# EAGLE schematic 3MIC_backplaneREVA (EAGLE 7.7.0)
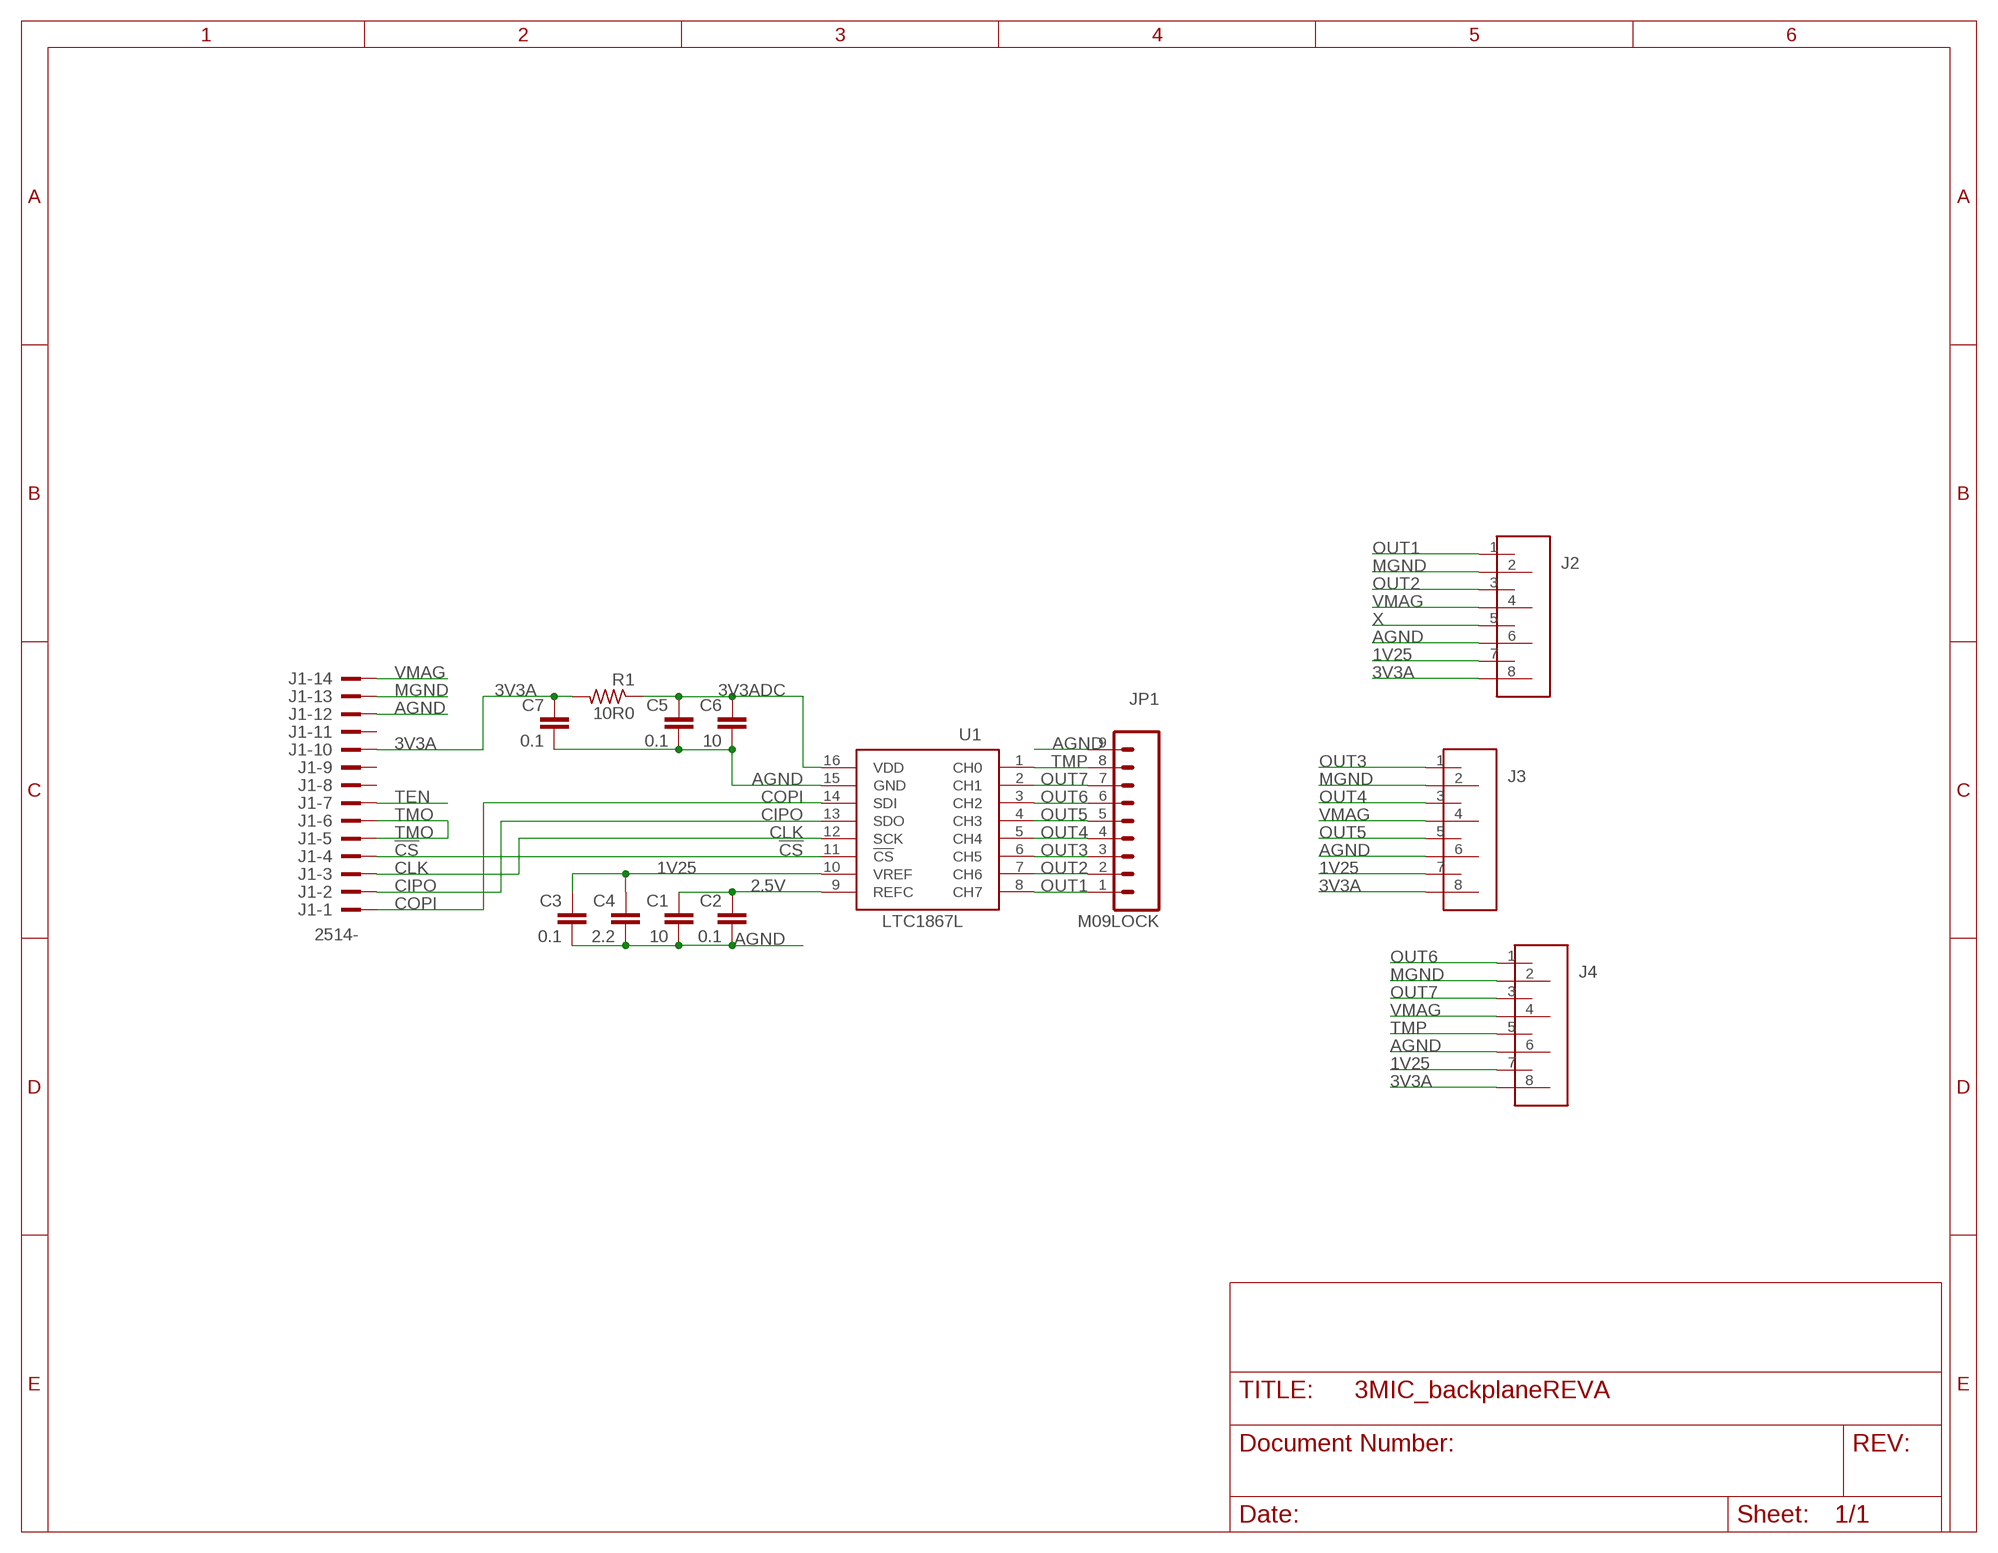
[diagram p0: schematic, sheet 1]

## Parts
C1  10  CAPS0805S  [0805S]
C2  0.1  CAPS0603S  [0603S]
C3  0.1  CAPS0603S  [0603S]
C4  2.2  CAPS0805S  [0805S]
C5  0.1  CAPS0603S  [0603S]
C6  10  CAPS0805S  [0805S]
C7  0.1  CAPS0603S  [0603S]
J1  2514-  [PAK100/2500-14]
J2  CON84X2SHROUDED  [4X2SHROUDED]
J3  CON84X2SHROUDED  [4X2SHROUDED]
J4  CON84X2SHROUDED  [4X2SHROUDED]
JP1  M09LOCK  [1X09_LOCK]
R1  10R0  RESISTOR_SM0805S  [0805S]
U1  LTC1867L  LTC1867  [SSOP16]

## Nets
1V25: C3.1 C4.1 J2.7 J3.7 J4.7 U1.10(VREF)
2.5V: C1.1 C2.1 U1.9(REFC)
3V3A: C7.1 J1.10 J2.8 J3.8 J4.8 R1.2
3V3ADC: C5.1 C6.1 R1.1 U1.16(VDD)
!CS: J1.4 U1.11(!CS)
AGND: C1.2 C2.2 C3.2 C4.2 C5.2 C6.2 C7.2 J1.12 J2.6 J3.6 J4.6 JP1.9 U1.15(GND)
CIPO: J1.2 U1.13(SDO)
CLK: J1.3 U1.12(SCK)
COPI: J1.1 U1.14(SDI)
MGND: J1.13 J2.2 J3.2 J4.2
OUT1: J2.1 JP1.1 U1.8(CH7)
OUT2: J2.3 JP1.2 U1.7(CH6)
OUT3: J3.1 JP1.3 U1.6(CH5)
OUT4: J3.3 JP1.4 U1.5(CH4)
OUT5: J3.5 JP1.5 U1.4(CH3)
OUT6: J4.1 JP1.6 U1.3(CH2)
OUT7: J4.3 JP1.7 U1.2(CH1)
TEN: J1.7
TMO: J1.5 J1.6
TMP: J4.5 JP1.8 U1.1(CH0)
VMAG: J1.14 J2.4 J3.4 J4.4
X: J2.5
Unconnected: J1.8 J1.9 J1.11

## Library data of the parts
C1-C7 = STEVES_BU:CAPS
J1 = con-3m:2514-: 3M (TM) Pak 100 4-Wall Header Source: 3M; OC_FARNELL: unknown; OC_NEWARK: unknown
J2-J4 = STEVES_HOME:CON8
JP1 = SparkFun:M09: Header 9 Standard 9-pin 0.1" header. Use with straight break away headers (SKU : PRT-00116), right angle break away headers (PRT-00553), swiss pins (PRT-00743), machine pins (PRT-00117), and female headers (PRT-00115).
R1 = STEVES_BU:RESISTOR_SM
U1 = linear-technology:LTC1867